# EAGLE design DLPG main v3 (EAGLE 7.7.0)
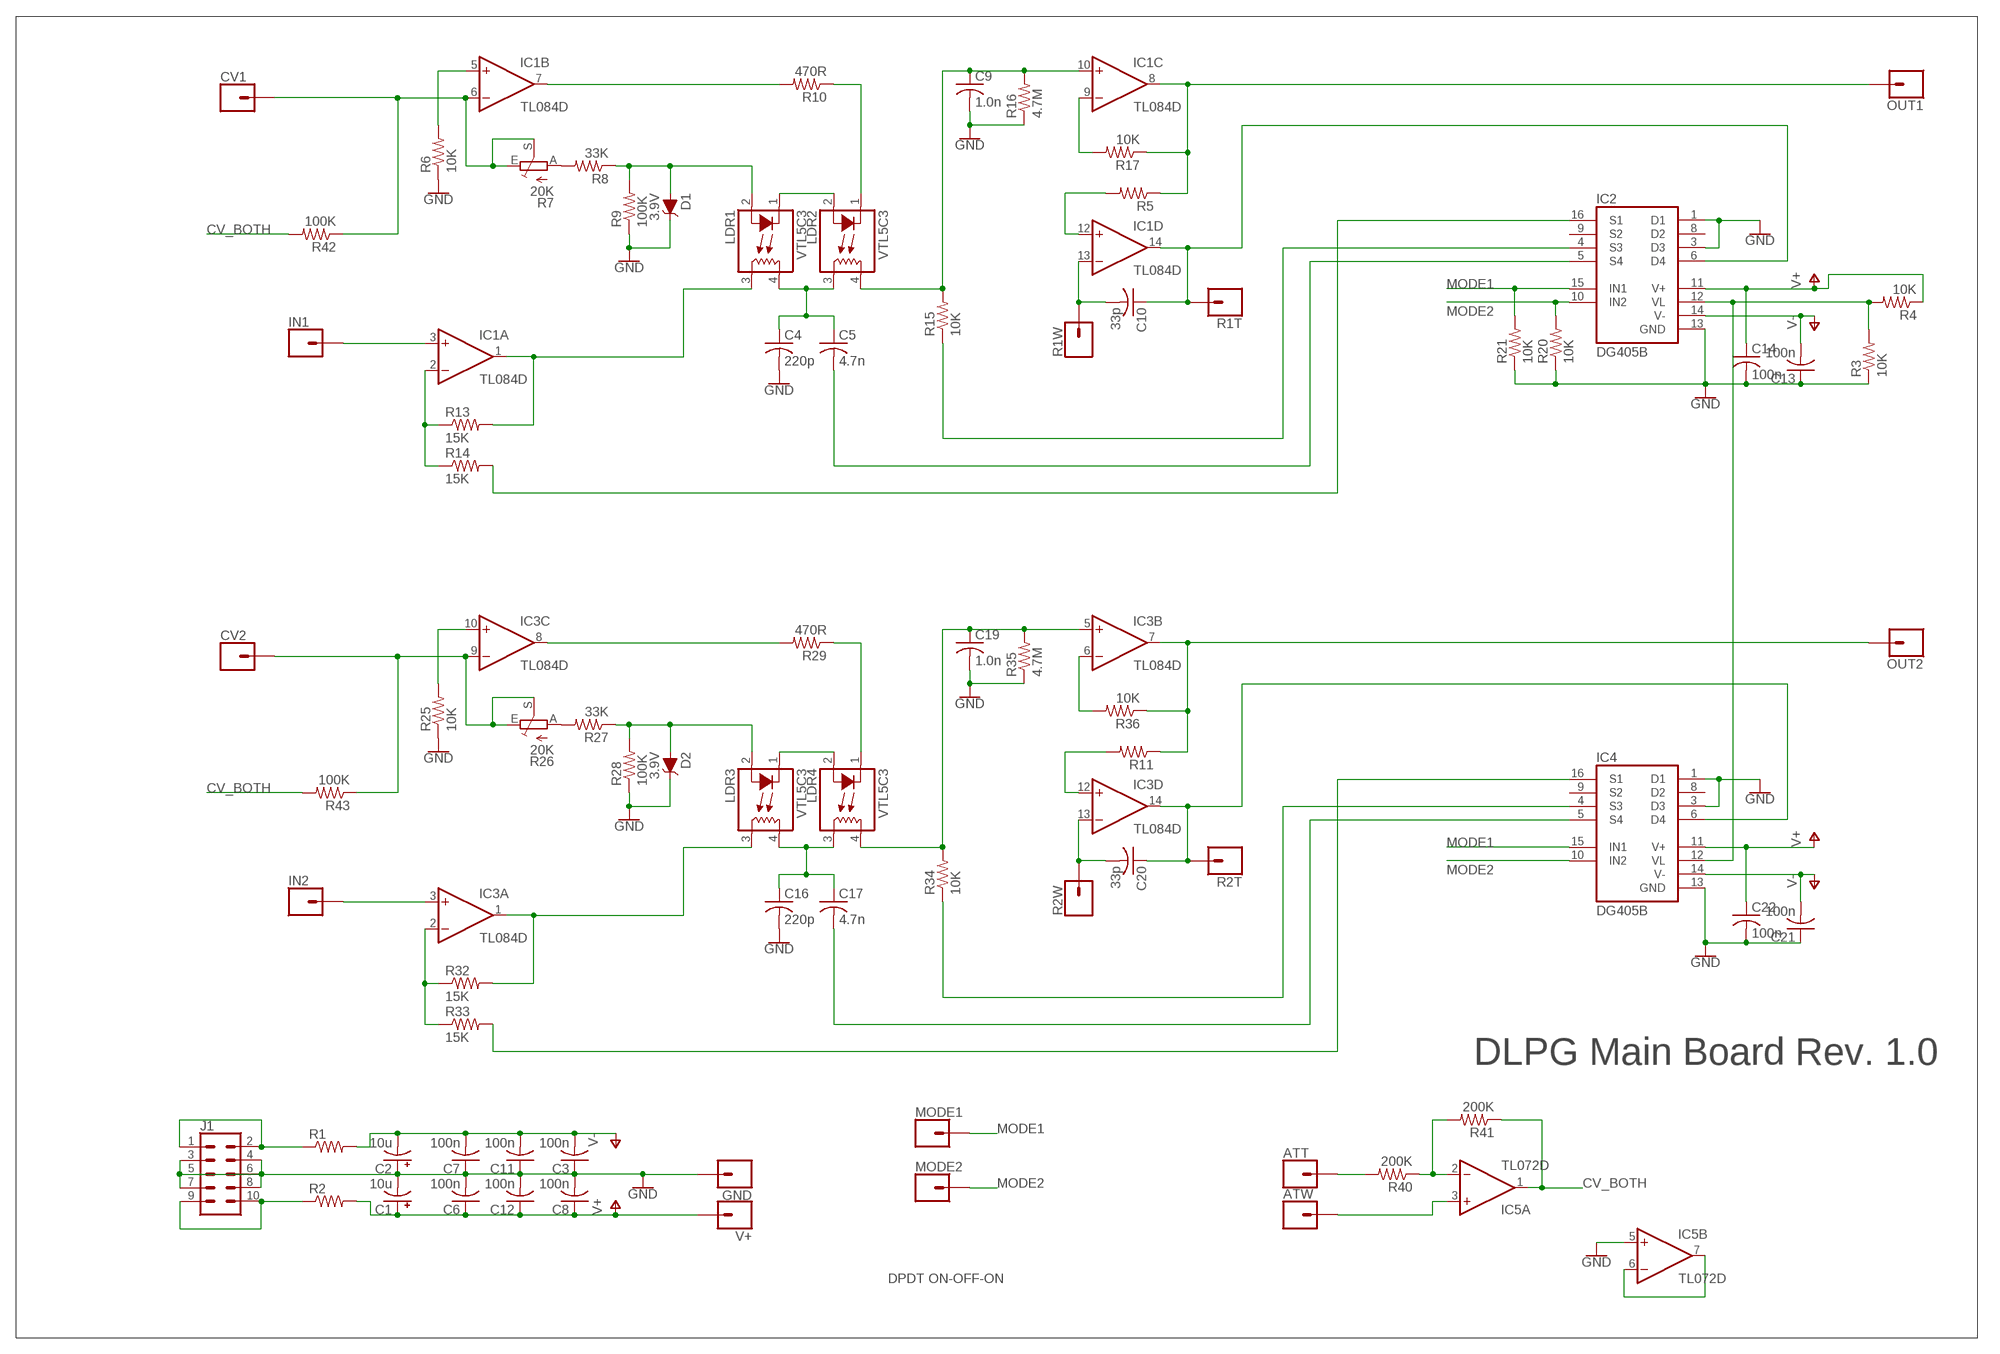
[diagram p0: schematic, sheet 1]

## Parts
ATT  CONN_01  [1X01]
ATW  CONN_01  [1X01]
C1  10u  CAP_POLC  [PANASONIC_C]
C2  10u  CAP_POLC  [PANASONIC_C]
C3  100n  C-USC0805K  [C0805K]
C4  220p  C-USC0805K  [C0805K]
C5  4.7n  C-USC0805K  [C0805K]
C6  100n  C-USC0805K  [C0805K]
C7  100n  C-USC0805K  [C0805K]
C8  100n  C-USC0805K  [C0805K]
C9  1.0n  C-USC0805K  [C0805K]
C10  33p  C-USC0805K  [C0805K]
C11  100n  C-USC0805K  [C0805K]
C12  100n  C-USC0805K  [C0805K]
C13  100n  C-USC0805K  [C0805K]
C14  100n  C-USC0805K  [C0805K]
C16  220p  C-USC0805K  [C0805K]
C17  4.7n  C-USC0805K  [C0805K]
C19  1.0n  C-USC0805K  [C0805K]
C20  33p  C-USC0805K  [C0805K]
C21  100n  C-USC0805K  [C0805K]
C22  100n  C-USC0805K  [C0805K]
CV1  CONN_01  [1X01]
CV2  CONN_01  [1X01]
D1  3.9V  DIODE-ZENER-MM3Z3V3T1G  [SOD-323]
D2  3.9V  DIODE-ZENER-MM3Z3V3T1G  [SOD-323]
GND  CONN_01  [1X01]
IC1  TL084D  [SO14]
IC2  DG405B  DG405CY  [SO16]
IC3  TL084D  [SO14]
IC4  DG405B  DG405CY  [SO16]
IC5  TL072D  [SO08]
IN1  CONN_01  [1X01]
IN2  CONN_01  [1X01]
J1  CONN_05X2PTH  [2X5]
LDR1  VTL5C3  VTL5C9  [VTL5C]
LDR2  VTL5C3  VTL5C9  [VTL5C]
LDR3  VTL5C3  VTL5C9  [VTL5C]
LDR4  VTL5C3  VTL5C9  [VTL5C]
MODE1  CONN_01  [1X01]
MODE2  CONN_01  [1X01]
OUT1  CONN_01  [1X01]
OUT2  CONN_01  [1X01]
R1  RESISTOR0805-RES  [0805]
R1T  CONN_01  [1X01]
R1W  CONN_01  [1X01]
R2  RESISTOR0805-RES  [0805]
R2T  CONN_01  [1X01]
R2W  CONN_01  [1X01]
R3  10K  R-US_M0805  [M0805]
R4  10K  R-US_M0805  [M0805]
R5  R-US_M0805  [M0805]
R6  10K  R-US_M0805  [M0805]
R7  20K  TRIM_1234-S64YW  [S64YW]
R8  33K  R-US_M0805  [M0805]
R9  100K  R-US_M0805  [M0805]
R10  470R  R-US_M0805  [M0805]
R11  R-US_M0805  [M0805]
R13  15K  R-US_M0805  [M0805]
R14  15K  R-US_M0805  [M0805]
R15  10K  R-US_M0805  [M0805]
R16  4.7M  R-US_M0805  [M0805]
R17  10K  R-US_M0805  [M0805]
R20  10K  R-US_M0805  [M0805]
R21  10K  R-US_M0805  [M0805]
R25  10K  R-US_M0805  [M0805]
R26  20K  TRIM_1234-S64YW  [S64YW]
R27  33K  R-US_M0805  [M0805]
R28  100K  R-US_M0805  [M0805]
R29  470R  R-US_M0805  [M0805]
R32  15K  R-US_M0805  [M0805]
R33  15K  R-US_M0805  [M0805]
R34  10K  R-US_M0805  [M0805]
R35  4.7M  R-US_M0805  [M0805]
R36  10K  R-US_M0805  [M0805]
R40  200K  R-US_M0805  [M0805]
R41  200K  R-US_M0805  [M0805]
R42  100K  R-US_M0805  [M0805]
R43  100K  R-US_M0805  [M0805]
V+  CONN_01  [1X01]

## Nets
CV_BOTH: IC5.1(A:OUT) R41.1 R42.2 R43.2
GND: C1.- C2.+ C3.1 C4.2 C6.2 C7.1 C8.2 C9.2 C11.1 C12.2 C13.1 C14.2 C16.2 C19.2 C21.1 C22.2 D1.C D2.C GND.1 IC2.1(D1) IC2.3(D3) IC2.13(GND) IC4.1(D1) IC4.3(D3) IC4.13(GND) IC5.5(B:+IN) J1.3 J1.4 J1.5 J1.6 J1.7 J1.8 R3.1 R6.1 R9.1 R16.1 R20.1 R21.1 R25.1 R28.1 R35.1
MODE1: IC2.15(IN1) IC4.15(IN1) MODE1.1 R21.2
MODE2: IC2.10(IN2) IC4.10(IN2) MODE2.1 R20.2
N$1: J1.1 J1.2 R1.1
N$2: J1.9 J1.10 R2.1
N$3: IC1.7(B:OUT) R10.2
N$4: LDR2.1(C) R10.1
N$5: IC2.12(VL) IC4.12(VL) R3.2 R4.2
N$6: IC1.3(A:+IN) IN1.1
N$7: IC1.2(A:-IN) R13.1 R14.1
N$8: IC1.12(D:+IN) R5.2
N$9: CV1.1 IC1.6(B:-IN) R7.E R7.S R42.1
N$10: IC3.12(D:+IN) R11.2
N$12: IC1.1(A:OUT) LDR1.3(L1) R13.2
N$13: C4.1 C5.1 LDR1.4(L2) LDR2.3(L1)
N$14: IC1.5(B:+IN) R6.2
N$15: R7.A R8.2
N$16: D1.A LDR1.2(A) R8.1 R9.2
N$17: LDR1.1(C) LDR2.2(A)
N$18: C9.1 IC1.10(C:+IN) LDR2.4(L2) R15.2 R16.2
N$19: IC1.9(C:-IN) R17.2
N$20: IC1.8(C:OUT) OUT1.1 R5.1 R17.1
N$23: C10.2 IC1.13(D:-IN) R1W.1
N$25: IC2.4(S3) R15.1
N$26: C5.2 IC2.5(S4)
N$27: IC2.16(S1) R14.2
N$29: CV2.1 IC3.9(C:-IN) R26.E R26.S R43.1
N$32: IC3.10(C:+IN) R25.2
N$33: R26.A R27.2
N$34: D2.A LDR3.2(A) R27.1 R28.2
N$35: LDR3.1(C) LDR4.2(A)
N$36: IC3.8(C:OUT) R29.2
N$37: LDR4.1(C) R29.1
N$39: IC3.3(A:+IN) IN2.1
N$40: IC3.2(A:-IN) R32.1 R33.1
N$41: IC3.1(A:OUT) LDR3.3(L1) R32.2
N$42: C16.1 C17.1 LDR3.4(L2) LDR4.3(L1)
N$43: C19.1 IC3.5(B:+IN) LDR4.4(L2) R34.2 R35.2
N$44: IC3.6(B:-IN) R36.2
N$45: IC3.7(B:OUT) OUT2.1 R11.1 R36.1
N$46: C20.1 IC3.14(D:OUT) IC4.6(D4) R2T.1
N$47: C20.2 IC3.13(D:-IN) R2W.1
N$49: IC4.4(S3) R34.1
N$50: C17.2 IC4.5(S4)
N$51: IC4.16(S1) R33.2
N$52: ATT.1 R40.2
N$53: ATW.1 IC5.3(A:+IN)
N$54: IC5.2(A:-IN) R40.1 R41.2
N$55: IC5.6(B:-IN) IC5.7(B:OUT)
N$56: C10.1 IC1.14(D:OUT) IC2.6(D4) R1T.1
V+: C1.+ C6.1 C8.1 C12.1 C14.1 C22.1 IC2.11(V+) IC4.11(V+) R2.2 R4.1 V+.1
V-: C2.- C3.2 C7.2 C11.2 C13.2 C21.2 IC2.14(V-) IC4.14(V-) R1.2
Unconnected: IC2.8(D2) IC2.9(S2) IC4.8(D2) IC4.9(S2) R7.S@1(S) R26.S@1(S)

## Notes on the sheet
- DLPG Main Board Rev. 1.0
- DPDT ON-OFF-ON

## Power pins joined to a net without a drawn wire
V+: IC1.4(P:V+) IC3.4(P:V+) IC5.8(P:V+)
V-: IC1.11(P:V-) IC3.11(P:V-) IC5.4(P:V-)

## Library data of the parts
ATT ATW CV1 CV2 GND IN1 IN2 MODE1 MODE2 OUT1 OUT2 R1T R1W R2T R2W V+ = SparkFun-Connectors:CONN_01: Single connection point. Often used as Generic Header-pin footprint for 0.1 inch spaced/style header connections On any of the 0.1 inch spaced packages, you can populate with these: Break Away Headers - Straight <https://www.sparkfun.com/products/116> (PRT-00116) Break Away Male Headers - Right Angle <https://www.sparkfun.com/products/553> (PRT-00553) Female Headers <https://www.sparkfun.com/products/115> (PRT-00115) Break Away Headers - Machine Pin <https://www.sparkfun.com/products/117> (PRT-00117) Break Away Female Headers - Swiss Machine Pin <https://www.sparkfun.com/products/743> (PRT-00743) This device is also useful as a general connection point to wire up your design to another part of your project. Our various solder wires solder well into these plated through hole pads. Hook-Up Wire - Assortment (Stranded, 22 AWG) <https://www.sparkfun.com/products/11375> (PRT-11375) Hook-Up Wire - Assortment (Solid Core, 22 AWG) <https://www.sparkfun.com/products/11367> (PRT-11367) View the entire wire category on our website here <https://www.sparkfun.com/categories/141> Special notes: SMTSO-256-ET is a "flush mount" nut for a 4-40 screw. We mostly use this on specialty testbeds; it is a nice way to connect hardware to your PCB at an adjustable hieght. Also note, the SNAP packages are for using a snappable style connector. We sell a baggie of snaps and they are also used on two LilyPad designs: Snap Assortment - 30 pack (male and female) <https://www.sparkfun.com/products/11347> (DEV-11347) LilyPad Arduino SimpleSnap <https://www.sparkfun.com/products/10941> (DEV-10941) LilyPad SimpleSnap Protoboard <https://www.sparkfun.com/products/10940> (DEV-10940)
C1 C2 = SparkFun-Passives:CAP_POL: Capacitor Polarized These are standard SMD and PTH capacitors. Normally 10uF, 47uF, and 100uF in electrolytic and tantalum varieties. Always verify the external diameter of the through hole cap, it varies with capacity, voltage, and manufacturer. The EIA devices should be standard.
C3-C14 C16 C17 C19-C22 = rcl:C-US: CAPACITOR, American symbol
D1 D2 = SparkFun-DiscreteSemi:DIODE-ZENER: Zener Diode A Zener diode allows current to flow from its anode to its cathode like a normal semiconductor diode, but it also permits current to flow in the reverse direction when its "Zener voltage" is reached. - WIkipedia; PROD_ID: DIO-11284; VALUE: 3.3V
IC1 IC3 = linear:TL084: OP AMP
IC2 IC4 = maxim:DG405CY: ANALOG SWITCH; MPN: DG405CY+; OC_FARNELL: unknown; OC_NEWARK: 18M7221
IC5 = linear:TL072: OP AMP
J1 = SparkFun-Connectors:CONN_05X2: Multi connection point. Often used as Generic Header-pin footprint for 0.1 inch spaced/style header connections For AVR SPI programming port, see special device with nice symbol: "AVR_SPI_PROG_5x2.dev" You can populate with any combo of single row headers, but if you'd like an exact match, check these: 2x5 AVR ICSP Male Header <https://www.sparkfun.com/products/778> (PRT-00778) 2x5 Pin Shrouded Header <https://www.sparkfun.com/products/8506> (PRT-08506) On any of the 0.1 inch spaced packages, you can populate with these: Break Away Headers - Straight <https://www.sparkfun.com/products/116> (PRT-00116) Break Away Male Headers - Right Angle <https://www.sparkfun.com/products/553> (PRT-00553) Female Headers <https://www.sparkfun.com/products/115> (PRT-00115) Break Away Headers - Machine Pin <https://www.sparkfun.com/products/117> (PRT-00117) Break Away Female Headers - Swiss Machine Pin <https://www.sparkfun.com/products/743> (PRT-00743) Special note: the shrouded connector mates well with our 5x2 ribbon cables: 2x5 Pin IDC Ribbon Cable <https://www.sparkfun.com/products/8535> (PRT-08535); PROD_ID: CONN-08499; SF_ID: PRT-0778
LDR1-LDR4 = optocoupler:VTL5C*: Low Cost Axial Vactrols Source: www.perkinelmer.com/opto ... vtl5c9_c10.pdf; MF: VACTEC PHOTO; MPN: VTL5C9; OC_FARNELL: 2067857; OC_NEWARK: 95F9033
R1 R2 = SparkFun-Passives:RESISTOR: Resistor Basic schematic elements and footprints for 0603, 1206, and PTH resistors.
R3-R6 R8-R11 R13-R17 R20 R21 R25 R27-R29 R32-R36 R40-R43 = rcl:R-US_: RESISTOR, American symbol
R7 R26 = pot:TRIM_1234-: POTENTIOMETER

## Board
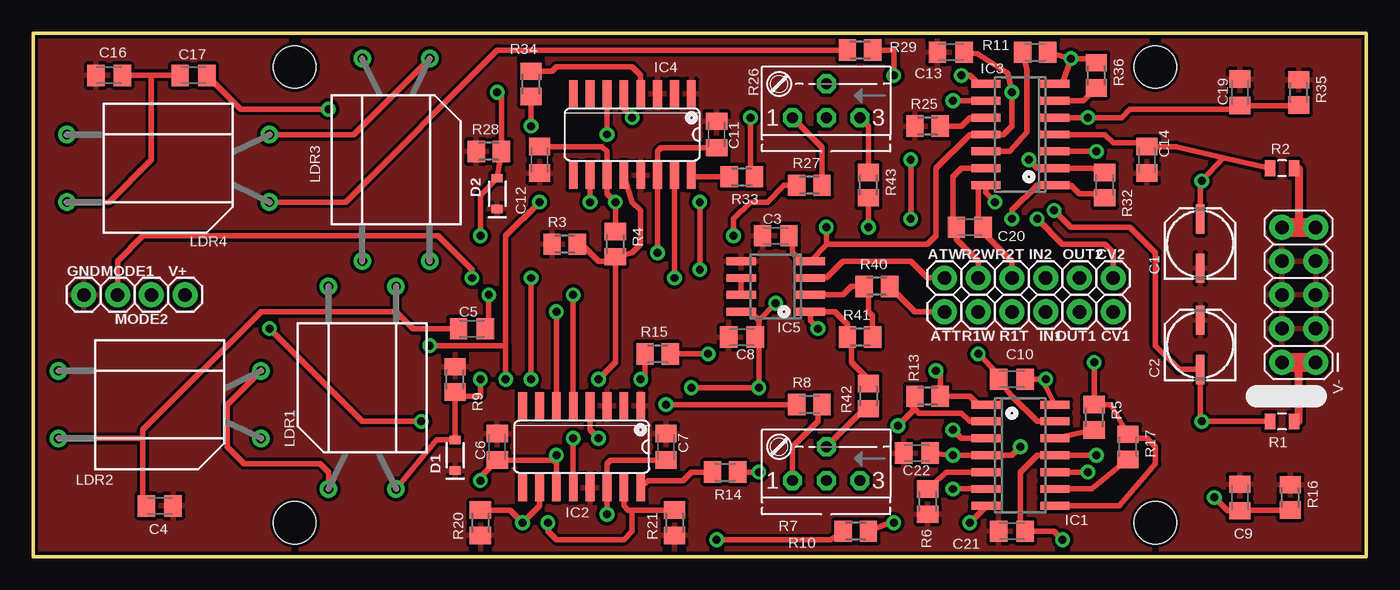
[diagram p1: board, top side]
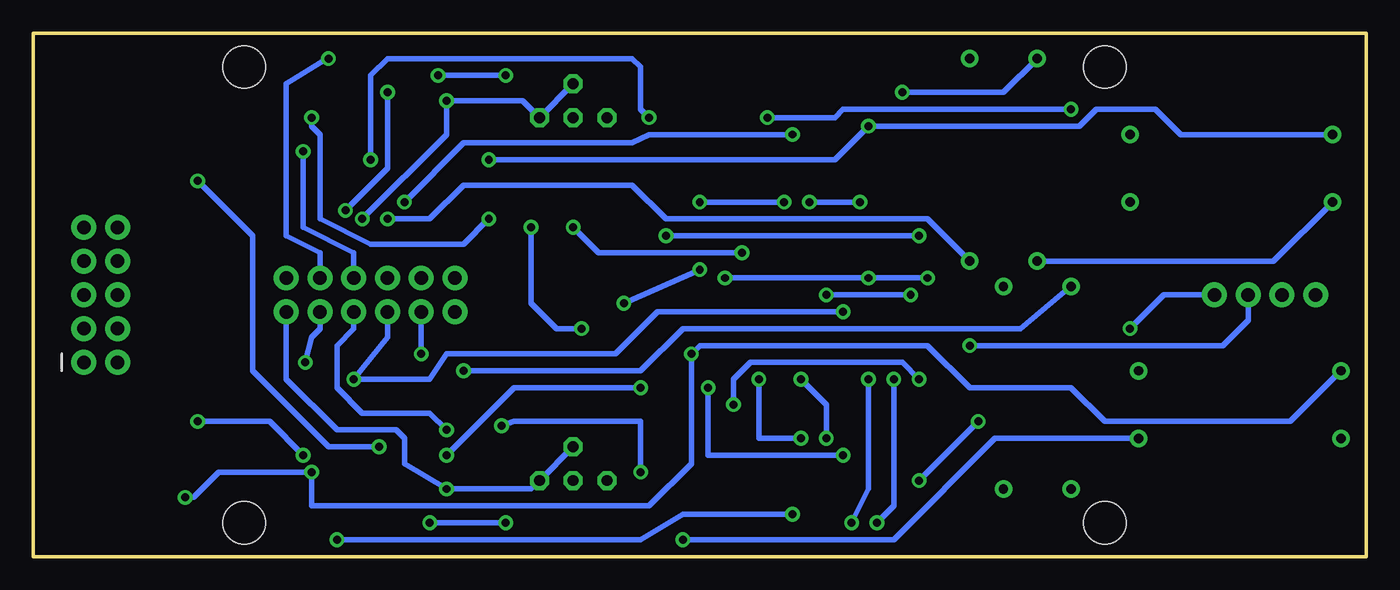
[diagram p2: board, bottom side, seen from below]

Size 100.33 x 39.37 mm. Coordinates in mm from the lower left corner, seen from the top.
Outline: 0,0 100,0
Outline: 0,0 0,39.37 100.33,39.37 100.33,0 0,0
Copper layers (1*16): Top 0.035mm / dielectric 1.5mm / Bottom 0.035mm
Design rules "SparkFun": minimum track width 8mil, minimum drill 20mil, track to track 8mil, track to pad 8mil, pad to pad 8mil, via to via 8mil, smd to smd 8mil, copper to edge 10mil, drill to drill 8mil, minimum pad ring 12mil, minimum via ring 10mil, stop-mask expansion 4mil, vias tented up to drill 25mil, thermal gap 10mil
Holes 3.2 mm at 84.45,2.54 19.68,2.54 19.68,36.83 84.45,36.83

### Footprints (pad centres in the part's own frame; a part is rotated, then mirrored left to right if it is on the bottom)
1X01 = drill 1.016 pad 1.88: 1 0,0
PANASONIC_C = smd 2.2 x 0.65: + 1.9,-0.2; - -1.8,-0.2
C0805K = smd 1.3 x 1.6: 1 -1,0; 2 1,0
SOD-323 = smd 0.63 x 0.83: A 1.15,0; C -1.15,0
SO14 = smd 0.6 x 2.2: 1 -3.81,-2.6; 2 -2.54,-2.6; 3 -1.27,-2.6; 4 0,-2.6; 5 1.27,-2.6; 6 2.54,-2.6; 7 3.81,-2.6; 8 3.81,2.6; 9 2.54,2.6; 10 1.27,2.6; 11 0,2.6; 12 -1.27,2.6; 13 -2.54,2.6; 14 -3.81,2.6
SO16 = smd 0.66 x 2.032: 1 -4.445,-3.073; 2 -3.175,-3.073; 3 -1.905,-3.073; 4 -0.635,-3.073; 5 0.635,-3.073; 6 1.905,-3.073; 7 3.175,-3.073; 8 4.445,-3.073; 9 4.445,3.073; 10 3.175,3.073; 11 1.905,3.073; 12 0.635,3.073; 13 -0.635,3.073; 14 -1.905,3.073; 15 -3.175,3.073; 16 -4.445,3.073
SO08 = smd 0.6 x 2.2: 1 -1.905,-2.6; 2 -0.635,-2.6; 3 0.635,-2.6; 4 1.905,-2.6; 5 1.905,2.6; 6 0.635,2.6; 7 -0.635,2.6; 8 -1.905,2.6
2X5 = drill 1.016 pad 1.88: 1 0,0; 2 0,2.54; 3 2.54,0; 4 2.54,2.54; 5 5.08,0; 6 5.08,2.54; 7 7.62,0; 8 7.62,2.54; 9 10.16,0; 10 10.16,2.54
VTL5C = drill 0.7 pad 1.3: 1 -7.62,2.54; 2 -7.62,-2.54; 3 7.62,2.54; 4 7.62,-2.54
0805 = smd 0.8 x 1.2: 1 -0.9,0; 2 0.9,0
M0805 = smd 1.3 x 1.6: 1 -0.95,0; 2 0.95,0
S64YW = drill 0.813 octagon: A 2.54,1.27; E -2.54,1.27; S 0,-1.27; S@1 0,1.27

### Placement (x,y rotation side)
ATT  68.58,18.41 180 top
ATW  68.58,20.95 0 top
C1  87.63,23.5 90 top
C2  87.63,15.88 90 top
C3  55.88,24.13 0 top
C4  9.53,3.81 0 top
C5  33.02,17.14 0 top
C6  34.92,8.26 90 top
C7  47.62,8.26 270 top
C8  53.34,16.51 180 top
C9  90.81,4.45 90 top
C10  73.66,13.34 180 top
C11  51.44,31.75 270 top
C12  38.1,29.84 270 top
C13  69.06,37.94 0 top
C14  83.82,29.84 270 top
C16  5.71,36.2 180 top
C17  12.06,36.2 0 top
C19  90.81,34.92 90 top
C20  70.48,24.77 180 top
C21  73.66,1.91 0 top
C22  66.52,7.78 180 top
CV1  81.28,18.41 180 top
CV2  81.28,20.95 0 top
D1  31.75,7.62 90 top
D2  34.92,27.3 90 top
GND  3.81,19.68 0 top
IC1  74.3,7.62 270 top
IC2  41.27,8.26 180 top
IC3  74.3,31.75 90 top
IC4  45.09,31.75 180 top
IC5  55.88,20.32 90 top
IN1  76.2,18.41 180 top
IN2  76.2,20.95 0 top
J1  96.52,14.61 90 top
LDR1  24.77,12.7 90 top
LDR2  9.53,11.43 180 top
LDR3  27.3,29.84 270 top
LDR4  10.16,29.21 180 top
MODE1  6.35,19.68 0 top
MODE2  8.89,19.68 180 top
OUT1  78.74,18.41 180 top
OUT2  78.74,20.95 0 top
R1  93.98,10.16 180 top
R1T  73.66,18.41 180 top
R1W  71.12,18.41 180 top
R2  93.98,29.21 180 top
R2T  73.66,20.95 0 top
R2W  71.12,20.95 0 top
R3  40.01,23.5 0 top
R4  43.81,23.5 270 top
R5  79.85,10.48 270 top
R6  67.31,4.13 90 top
R7  59.69,6.99 180 top
R8  58.42,11.43 0 top
R9  31.75,13.34 270 top
R10  61.91,1.91 0 top
R11  75.41,37.94 180 top
R13  67.31,12.06 0 top
R14  52.07,6.35 180 top
R15  46.99,15.24 0 top
R16  94.61,4.45 270 top
R17  82.39,8.26 270 top
R20  33.66,2.54 90 top
R21  48.26,2.54 90 top
R25  67.31,32.38 0 top
R26  59.69,34.29 180 top
R27  58.42,27.94 0 top
R28  34.29,30.48 0 top
R29  62.23,38.1 0 top
R32  80.64,27.94 270 top
R33  53.34,28.57 180 top
R34  37.47,35.56 270 top
R35  95.25,34.92 270 top
R36  80.01,36.2 270 top
R40  63.5,20.32 0 top
R41  62.23,16.51 0 top
R42  62.87,12.06 90 top
R43  62.87,27.94 270 top
V+  11.43,19.68 0 top

### Tracks (layer width: path | path; a pad name or v marks a point on that pad's centre or on a via)
CV_BOTH  (via drill 0.6)
  Top 0.406: R42.2 62.87,13.34 61.59,14.61 61.59,16.2 R41.1 61.28,17.46 60.33,18.41 IC5.1 58.48,17.72 v59.05,17.14 | v62.87,24.77 R43.2
  Bottom 0.406: v59.05,17.14 60.96,17.14 62.87,19.05 v62.87,24.77
GND
  pour Top (isolate 0.254): 0,0 0,39.37 100.33,39.37 100.33,0
MODE1  (via drill 0.6)
  Top 0.406: 45.09,3.49 R21.2 | 45.09,3.49 44.77,3.49 | 44.77,3.49 44.45,3.81 IC2.15 | 44.77,3.49 | v37.47,13.34 v37.47,20.95 | v48.26,20.95 IC4.15 | MODE1.1 6.35,22.23 8.26,24.13 30.48,24.13 33.02,21.59 v33.02,20.95 | v38.73,2.54 38.73,1.91 39.37,1.27 44.45,1.27 45.09,1.91 45.09,3.49
  Bottom 0.406: v38.73,2.54 37.47,5.08 v37.47,13.34 | v48.26,20.95 v37.47,20.95 v33.02,20.95
MODE2  (via drill 0.6)
  Top 0.406: IC2.10 38.1,3.81 v36.83,2.54 35.88,3.49 R20.2 | 35.56,15.88 v35.56,13.34 | 35.56,15.88 35.56,24.13 v38.1,26.67 | v29.84,15.88 35.56,15.88 | v41.91,26.67 IC4.10
  Bottom 0.406: v36.83,2.54 35.56,3.81 v35.56,13.34 | MODE2.1 8.89,17.78 10.79,15.88 v29.84,15.88 | v38.1,26.67 v41.91,26.67
N$1
  Top 0.61: R1.1 95.25,10.16 95.25,14.61
  Top 1.422: J1.2 95.25,14.61 J1.1
N$2
  Top 0.61: R2.1 95.25,29.21 95.25,24.77
  Top 1.422: J1.10 95.25,24.77 J1.9
N$3  (via drill 0.6)
  Top 0.406: IC1.7 71.69,3.75 v70.48,2.54 | v64.77,2.54 64.45,2.54 R10.2
  Bottom 0.406: v70.48,2.54 v64.77,2.54
N$4  (via drill 0.6)
  Top 0.406: v51.44,1.27 60.01,1.27 R10.1
  Bottom 0.406: v51.44,1.27 35.56,1.27 27.94,8.89 LDR2.1
N$5  (via drill 0.6)
  Top 0.406: R3.2 41.27,23.5 42.55,22.23 43.49,22.23 R4.2 | IC2.12 v40.64,8.89 | v42.55,13.34 43.81,14.61 R4.2 | IC4.12 45.09,26.67 45.72,26.04 45.72,23.5 45.09,22.86 R4.2
  Bottom 0.406: v40.64,8.89 40.64,11.43 v42.55,13.34
N$6  (via drill 0.6)
  Top 0.406: IC1.3 69.85,8.89 v69.22,9.53
  Bottom 0.406: IN1.1 76.2,17.14 77.47,15.88 77.47,12.7 75.56,10.79 70.48,10.79 v69.22,9.53
N$7  (via drill 0.6)
  Top 0.406: IC1.2 70.48,10.16 69.85,10.79 66.67,10.79 66.36,11.11 | 66.36,11.11 66.04,11.43 66.04,11.74 R13.1 | v65.09,9.84 66.36,11.11 | R14.1 v54.61,6.35
  Bottom 0.406: v65.09,9.84 64.14,10.16 54.61,10.16 v54.61,6.35
N$8
  Top 0.406: IC1.12 R5.2
N$9  (via drill 0.6)
  Top 0.406: IC1.6 v69.22,5.08 | R42.1 62.55,11.12 R7.S
  Bottom 0.406: R7.S R7.E 62.87,5.08 v69.22,5.08 72.39,6.99 72.39,8.89 73.03,9.53 77.47,9.53 81.28,13.34 CV1.1
N$10
  Top 0.406: IC3.12 73.5,30.48 74.77,31.91 74.77,36.67 R11.2
N$12  (via drill 0.6)
  Top 0.406: IC1.1 71.12,11.43 70.48,12.06 R13.2 68.26,13.65 v67.94,13.97
  Bottom 0.406: LDR1.3 26.04,17.14 51.44,17.14 54.61,13.97 v67.94,13.97
N$13
  Top 0.406: 27.3,18.41 LDR1.4 | 27.3,18.41 28.57,17.14 C5.1 | LDR2.3 8.26,8.89 | 8.26,8.89 8.26,4.08 C4.1 | 8.26,8.89 8.26,9.53 17.14,18.41 27.3,18.41
N$14
  Top 0.406: R6.2 68.74,6.35 IC1.5
N$15
  Top 0.406: R7.A 57.15,8.26 59.05,10.16 59.05,11.12 R8.2
N$16  (via drill 0.6)
  Top 0.406: LDR1.2 30.36,8.77 D1.A R9.2 32.07,12.06 33.66,12.06 v33.66,13.34 | R8.1 v47.62,11.43
  Bottom 0.406: v47.62,11.43 47.62,13.34 46.35,14.61 34.92,14.61 v33.66,13.34
N$17
  Top 0.406: LDR1.1 22.23,6.35 21.59,6.99 15.88,6.99 14.61,8.26 14.61,11.43 LDR2.2
N$18  (via drill 0.6)
  Top 0.406: IC1.10 v79.38,6.35 | v50.8,15.24 R15.2 | R16.2 90.86,3.5 C9.1 89.9,3.44 v88.9,4.45
  Bottom 0.406: v88.9,4.45 88.27,4.45 86.36,6.35 v79.38,6.35 79.38,3.81 53.98,3.81 50.8,6.99 v50.8,15.24 50.16,15.88 33.02,15.88 29.84,12.7 22.23,12.7 19.68,10.16 5.71,10.16 LDR2.4
N$19
  Top 0.406: IC1.9 79.69,5.08 R17.2
N$20  (via drill 0.6)
  Top 0.406: IC1.8 81.76,3.81 84.45,6.99 84.45,8.26 83.82,8.89 82.23,8.89 R17.1 81.12,11.43 R5.1 v79.85,14.61
  Bottom 0.406: OUT1.1 78.74,17.14 79.38,16.51 v79.85,14.61
N$23  (via drill 0.6)
  Top 0.406: v71.12,15.24 72.66,13.7 C10.2 73.66,12.06 75.56,10.16 IC1.13
  Bottom 0.406: v71.12,15.24 R1W.1
N$25  (via drill 0.6)
  Top 0.406: R15.1 46.04,13.65 v45.72,13.34 | v42.55,8.89 41.91,9.53 IC2.4
  Bottom 0.406: v45.72,13.34 45.72,8.89 v42.55,8.89
N$26  (via drill 0.6)
  Top 0.406: v40.64,19.68 IC2.5 | v34.29,19.68 34.29,17.41 C5.2
  Bottom 0.406: v34.29,19.68 v40.64,19.68
N$27
  Top 0.406: R14.2 49.53,6.35 48.9,5.71 46.25,5.71 IC2.16
N$29  (via drill 0.6)
  Top 0.406: CV2.1 81.28,22.86 80.64,23.5 77.47,23.5 v75.56,25.4 | v69.22,34.29 IC3.9 | R43.1 62.87,32.38 R26.E
  Bottom 0.406: v75.56,25.4 69.22,31.75 v69.22,34.29 63.5,34.29 R26.E R26.S
N$32
  Top 0.406: IC3.10 70.48,33.02 69.85,32.38 R25.2
N$33
  Top 0.406: R27.2 59.37,30.8 R26.A
N$34  (via drill 0.6)
  Top 0.406: R27.1 56.52,27.94 55.24,26.67 53.98,26.67 52.7,25.4 v52.7,24.13 | v33.66,24.13 33.66,27.18 D2.A R28.2 35.24,34.61 v34.92,34.92
  Bottom 0.406: v52.7,24.13 v33.66,24.13 | v34.92,34.92 27.3,34.92 LDR3.2
N$35
  Top 0.406: LDR4.2 24.13,31.75 LDR3.1
N$36  (via drill 0.6)
  Top 0.406: IC3.8 71.12,35.56 70.48,36.2 v69.85,36.2 | R29.2 64.77,38.1 v64.77,36.2
  Bottom 0.406: v64.77,36.2 v69.85,36.2
N$37
  Top 0.406: LDR4.1 23.5,26.67 34.92,38.1 R29.1
N$39  (via drill 0.6)
  Top 0.406: IC3.3 v80.01,30.48
  Bottom 0.406: IN2.1 76.2,22.86 80.01,24.77 v80.01,30.48
N$40  (via drill 0.6)
  Top 0.406: R32.1 79.69,29.21 IC3.2 75.56,29.21 v74.93,29.84 | v53.98,33.02 53.98,28.89 R33.1
  Bottom 0.406: v74.93,29.84 74.93,36.2 73.66,37.47 55.24,37.47 54.61,36.83 54.61,33.66 v53.98,33.02
N$41  (via drill 0.6)
  Top 0.406: R32.2 79.69,27.3 78.74,27.3 78.11,27.94 IC3.1 75.56,27.94 73.66,26.04 v73.66,25.4
  Bottom 0.406: v73.66,25.4 70.48,25.4 67.94,27.94 55.24,27.94 52.7,25.4 33.02,25.4 LDR3.3
N$42
  Top 0.406: LDR4.3 5.71,26.67 8.89,29.84 8.89,36.2 | 8.89,36.2 C16.1 | C17.1 8.89,36.2
  Bottom 0.406: LDR3.4 6.99,22.23 LDR4.3
N$43  (via drill 0.6)
  Top 0.406: R35.2 95.2,33.92 C19.1 90.53,33.66 82.55,33.66 81.92,33.02 v79.38,33.02 IC3.5 | v66.04,25.4 v66.04,29.84 | v37.47,32.38 R34.2
  Bottom 0.406: v79.38,33.02 79.38,32.38 78.74,31.75 78.74,25.4 74.93,23.5 67.94,23.5 v66.04,25.4 | v66.04,29.84 40.01,29.84 v37.47,32.38 21.59,32.38 20.32,33.66 15.88,33.66 13.97,31.75 LDR4.4
N$44
  Top 0.406: IC3.6 79.06,34.29 R36.2
N$45  (via drill 0.6)
  Top 0.406: IC3.7 77.47,35.56 v78.11,37.47 | R36.1 79.69,37.47 v78.11,37.47 | 78.27,37.46 v78.11,37.47 | R11.1 v78.11,37.47
  Bottom 0.406: v78.11,37.47 78.26,37.47 81.28,35.56 81.28,24.13 78.74,22.86 OUT2.1
N$46  (via drill 0.6)
  Top 0.406: R2T.1 73.66,22.23 71.48,24.4 C20.1 71.12,25.13 71.12,27.94 IC3.14 71.69,27.36 v72.39,26.67 | v43.18,31.75 IC4.6
  Bottom 0.406: v72.39,26.67 67.94,31.11 55.24,31.11 53.98,31.75 v43.18,31.75
N$47
  Top 0.406: IC3.13 69.85,29.21 69.22,28.57 69.22,25.04 C20.2 69.48,23.86 71.12,22.23 R2W.1
N$49
  Top 0.406: R34.1 39.05,36.51 39.37,36.83 45.09,36.83 45.72,36.2 IC4.4
N$50  (via drill 0.6)
  Top 0.406: IC4.5 44.45,33.66 v45.09,33.02 | v22.23,33.66 15.61,33.66 C17.2
  Bottom 0.406: v45.09,33.02 40.01,33.02 39.37,33.66 v22.23,33.66
N$51
  Top 0.406: R33.2 49.63,28.57 IC4.16
N$52
  Top 0.406: ATT.1 66.36,18.41 R40.2
N$53
  Top 0.406: ATW.1 67.31,20.95 66.04,22.23 60.96,22.23 59.69,20.95 IC5.3
N$54
  Top 0.406: IC5.2 60.96,19.68 61.59,20.32 R40.1 62.87,20 62.87,18.41 63.18,18.1 R41.2
N$55
  Top 0.406: IC5.6 IC5.7
N$56  (via drill 0.6)
  Top 0.406: 76.56,11.43 IC1.14 76.2,12.76 v76.2,13.34 C10.1 | v39.37,18.41 IC2.6
  Bottom 0.406: v39.37,18.41 53.34,18.41 56.52,15.24 69.22,15.24 70.48,13.34 v76.2,13.34 73.66,16.51 R1T.1
V+  (via drill 0.6)
  Top 0.406: v74.3,8.26 73.66,7.62 IC1.4 v69.22,7.62 C22.1 | 39.37,6.99 39.1,7.25 C6.1 33.66,5.99 v33.66,5.71 | 39.37,6.99 IC2.11 | v49.53,12.7 v54.61,12.7 54.61,16.24 C8.1 54.61,16.78 54.61,17.78 | v39.37,7.62 39.37,6.99 | C12.1 42.81,30.84 43.18,30.48 IC4.11 43.18,27.3 v43.81,26.67 R4.1 | IC3.4 80.64,31.75 81.28,31.11 83.55,31.11 C14.1 86,30.84 89.58,30.02 | v29.21,10.16 24.77,10.16 v17.78,17.14 | 89.58,30.02 R2.2 | IC5.8 53.98,18.41 54.61,17.78 | v50.16,26.67 v50.16,21.59 | v55.88,19.05 54.61,17.78 | 89.58,30.02 v87.95,28.26 87.83,28.26 C1.+
  Bottom 0.406: v74.3,8.26 78.11,8.26 83.82,13.97 83.82,24.13 v87.95,28.26 | v69.22,7.62 64.14,12.7 v54.61,12.7 | v49.53,12.7 49.53,7.62 v39.37,7.62 | v50.16,26.67 v43.81,26.67 | v29.21,10.16 v33.66,5.71 | v17.78,17.14 15.24,19.68 V+.1 | v50.16,21.59 v55.88,19.05
V-  (via drill 0.6)
  Top 0.406: v80.01,7.62 IC1.11 75.56,7.62 74.3,6.35 74.3,2.27 C21.2 76.83,1.91 v77.47,1.27 | C13.2 71.07,37.83 73.34,36.35 v73.66,34.92 73.66,32.38 73.03,31.75 IC3.11 70.48,31.75 67.94,29.21 67.94,24.13 67.31,23.5 59.75,23.5 | v76.83,26.04 78.11,24.77 82.55,24.77 84.45,22.86 84.45,15.88 86.25,14.07 C2.- 87.83,10.16 v87.95,10.16 R1.2 | C3.2 57.15,23.86 57.15,22.86 57.78,22.23 IC5.4 59.75,23.5 | C7.2 43.45,7.25 43.18,6.99 IC2.14 v43.18,3.17 | C11.2 47.26,30.75 46.99,30.48 IC4.14 v46.99,22.86 | v59.69,24.77 59.69,23.55 59.75,23.5
  Bottom 0.406: v80.01,7.62 82.55,10.16 v87.95,10.16 | v76.83,26.04 73.66,29.21 v73.66,34.92 | v43.18,3.17 51.44,3.17 54.61,1.27 v77.47,1.27 | v46.99,22.86 57.78,22.86 v59.69,24.77

### Text on the board
tPlace: V-